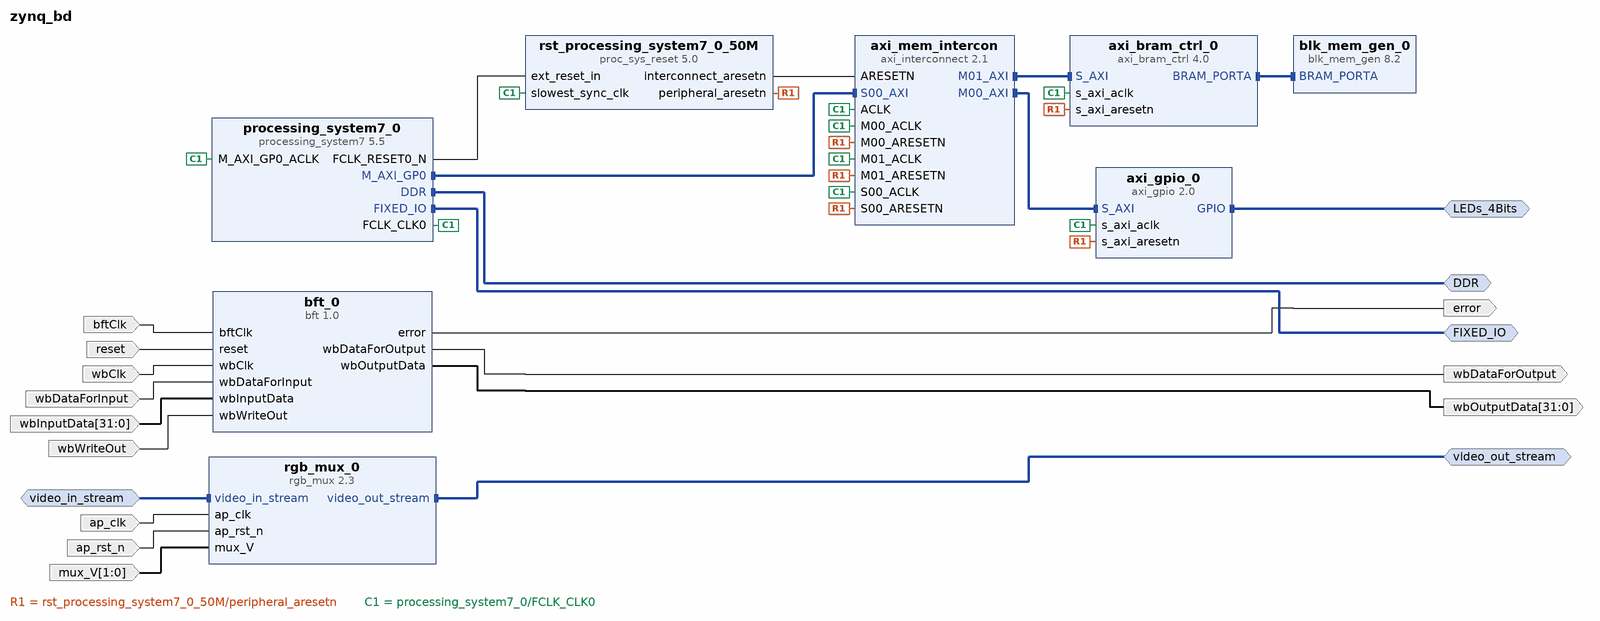
[diagram p0: block diagram of the top level]
# Vivado block design zynq_bd, Vivado 2014.3
create_bd_design zynq_bd

create_bd_intf_port -mode Master -vlnv xilinx.com:interface:ddrx_rtl:1.0 DDR
create_bd_intf_port -mode Master -vlnv xilinx.com:display_processing_system7:fixedio_rtl:1.0 FIXED_IO
create_bd_intf_port -mode Master -vlnv xilinx.com:interface:gpio_rtl:1.0 LEDs_4Bits
create_bd_intf_port -mode Slave -vlnv xilinx.com:interface:axis_rtl:1.0 video_in_stream
set_property -dict [list \
  CONFIG.TDATA_NUM_BYTES 3 \
  CONFIG.TDEST_WIDTH 0 \
  CONFIG.TID_WIDTH 0 \
  CONFIG.TUSER_WIDTH 1 \
  CONFIG.HAS_TREADY 1 \
  CONFIG.HAS_TSTRB 0 \
  CONFIG.HAS_TKEEP 0 \
  CONFIG.HAS_TLAST 1 \
  CONFIG.FREQ_HZ 100000000 \
  CONFIG.PHASE 0.000 \
  CONFIG.LAYERED_METADATA undef \
] [get_bd_intf_ports video_in_stream]
create_bd_intf_port -mode Master -vlnv xilinx.com:interface:axis_rtl:1.0 video_out_stream
create_bd_port -dir I -type clk ap_clk
create_bd_port -dir I -type rst ap_rst_n
create_bd_port -dir I bftClk
create_bd_port -dir O error
create_bd_port -dir I -from 1 -to 0 -type data mux_V
create_bd_port -dir I reset
create_bd_port -dir I wbClk
create_bd_port -dir I wbDataForInput
create_bd_port -dir O wbDataForOutput
create_bd_port -dir I -from 31 -to 0 wbInputData
create_bd_port -dir O -from 31 -to 0 wbOutputData
create_bd_port -dir I wbWriteOut

create_bd_cell -type ip -vlnv xilinx.com:ip:axi_bram_ctrl:4.0 axi_bram_ctrl_0
set_property -dict {CONFIG.SINGLE_PORT_BRAM 1} [get_bd_cells axi_bram_ctrl_0]
create_bd_cell -type ip -vlnv xilinx.com:ip:axi_gpio:2.0 axi_gpio_0
set_property -dict {CONFIG.USE_BOARD_FLOW true CONFIG.GPIO_BOARD_INTERFACE leds_4bits} [get_bd_cells axi_gpio_0]
create_bd_cell -type ip -vlnv xilinx.com:ip:axi_interconnect:2.1 axi_mem_intercon
set_property -dict {CONFIG.NUM_SI 1 CONFIG.NUM_MI 2} [get_bd_cells axi_mem_intercon]
create_bd_cell -type ip -vlnv xilinx.com:ip:bft:1.0 bft_0
create_bd_cell -type ip -vlnv xilinx.com:ip:blk_mem_gen:8.2 blk_mem_gen_0
create_bd_cell -type ip -vlnv xilinx.com:ip:processing_system7:5.5 processing_system7_0
set_property -dict {CONFIG.preset {ZC702*}} [get_bd_cells processing_system7_0]
create_bd_cell -type ip -vlnv xilinx.com:hls:rgb_mux:2.3 rgb_mux_0
create_bd_cell -type ip -vlnv xilinx.com:ip:proc_sys_reset:5.0 rst_processing_system7_0_50M

# ---- connections ----

connect_bd_intf_net [get_bd_intf_pins axi_bram_ctrl_0/BRAM_PORTA] [get_bd_intf_pins blk_mem_gen_0/BRAM_PORTA]
connect_bd_intf_net [get_bd_intf_pins axi_gpio_0/S_AXI] [get_bd_intf_pins axi_mem_intercon/M00_AXI]
connect_bd_intf_net [get_bd_intf_pins axi_bram_ctrl_0/S_AXI] [get_bd_intf_pins axi_mem_intercon/M01_AXI]
connect_bd_intf_net [get_bd_intf_pins axi_mem_intercon/S00_AXI] [get_bd_intf_pins processing_system7_0/M_AXI_GP0]
connect_bd_intf_net [get_bd_intf_ports DDR] [get_bd_intf_pins processing_system7_0/DDR]
connect_bd_intf_net [get_bd_intf_ports FIXED_IO] [get_bd_intf_pins processing_system7_0/FIXED_IO]
connect_bd_intf_net [get_bd_intf_ports LEDs_4Bits] [get_bd_intf_pins axi_gpio_0/GPIO]
connect_bd_intf_net [get_bd_intf_ports video_in_stream] [get_bd_intf_pins rgb_mux_0/video_in_stream]
connect_bd_intf_net [get_bd_intf_ports video_out_stream] [get_bd_intf_pins rgb_mux_0/video_out_stream]
connect_bd_net [get_bd_ports ap_clk] [get_bd_pins rgb_mux_0/ap_clk]
connect_bd_net [get_bd_ports ap_rst_n] [get_bd_pins rgb_mux_0/ap_rst_n]
connect_bd_net [get_bd_ports bftClk] [get_bd_pins bft_0/bftClk]
connect_bd_net [get_bd_pins bft_0/error] [get_bd_ports error]
connect_bd_net [get_bd_pins bft_0/wbDataForOutput] [get_bd_ports wbDataForOutput]
connect_bd_net [get_bd_pins bft_0/wbOutputData] [get_bd_ports wbOutputData]
connect_bd_net [get_bd_ports mux_V] [get_bd_pins rgb_mux_0/mux_V]
connect_bd_net -net proc_sys_reset_interconnect_aresetn [get_bd_pins rst_processing_system7_0_50M/interconnect_aresetn] \
  [get_bd_pins axi_mem_intercon/ARESETN]
connect_bd_net -net proc_sys_reset_peripheral_aresetn [get_bd_pins rst_processing_system7_0_50M/peripheral_aresetn] \
  [get_bd_pins axi_bram_ctrl_0/s_axi_aresetn] [get_bd_pins axi_gpio_0/s_axi_aresetn] \
  [get_bd_pins axi_mem_intercon/M00_ARESETN] [get_bd_pins axi_mem_intercon/M01_ARESETN] \
  [get_bd_pins axi_mem_intercon/S00_ARESETN]
connect_bd_net [get_bd_pins processing_system7_0/FCLK_CLK0] \
  [get_bd_pins axi_bram_ctrl_0/s_axi_aclk] [get_bd_pins axi_gpio_0/s_axi_aclk] [get_bd_pins axi_mem_intercon/ACLK] \
  [get_bd_pins axi_mem_intercon/M00_ACLK] [get_bd_pins axi_mem_intercon/M01_ACLK] [get_bd_pins axi_mem_intercon/S00_ACLK] \
  [get_bd_pins processing_system7_0/M_AXI_GP0_ACLK] [get_bd_pins rst_processing_system7_0_50M/slowest_sync_clk]
connect_bd_net [get_bd_pins processing_system7_0/FCLK_RESET0_N] [get_bd_pins rst_processing_system7_0_50M/ext_reset_in]
connect_bd_net [get_bd_ports reset] [get_bd_pins bft_0/reset]
connect_bd_net [get_bd_ports wbClk] [get_bd_pins bft_0/wbClk]
connect_bd_net [get_bd_ports wbDataForInput] [get_bd_pins bft_0/wbDataForInput]
connect_bd_net [get_bd_ports wbInputData] [get_bd_pins bft_0/wbInputData]
connect_bd_net [get_bd_ports wbWriteOut] [get_bd_pins bft_0/wbWriteOut]

# ---- address map ----
assign_bd_address -offset 0x40000000 -range 4K -target_address_space [get_bd_addr_spaces processing_system7_0/Data] [get_bd_addr_segs axi_bram_ctrl_0/S_AXI/Mem0]
assign_bd_address -offset 0x41200000 -range 64K -target_address_space [get_bd_addr_spaces processing_system7_0/Data] [get_bd_addr_segs axi_gpio_0/S_AXI/Reg]

validate_bd_design
save_bd_design
